# EasyEDA schematic meeting-meter-easyeda.json
TITLE: Meeting Meter; REV: RC5; Date: 2019-12-18; Sheet: 1/1
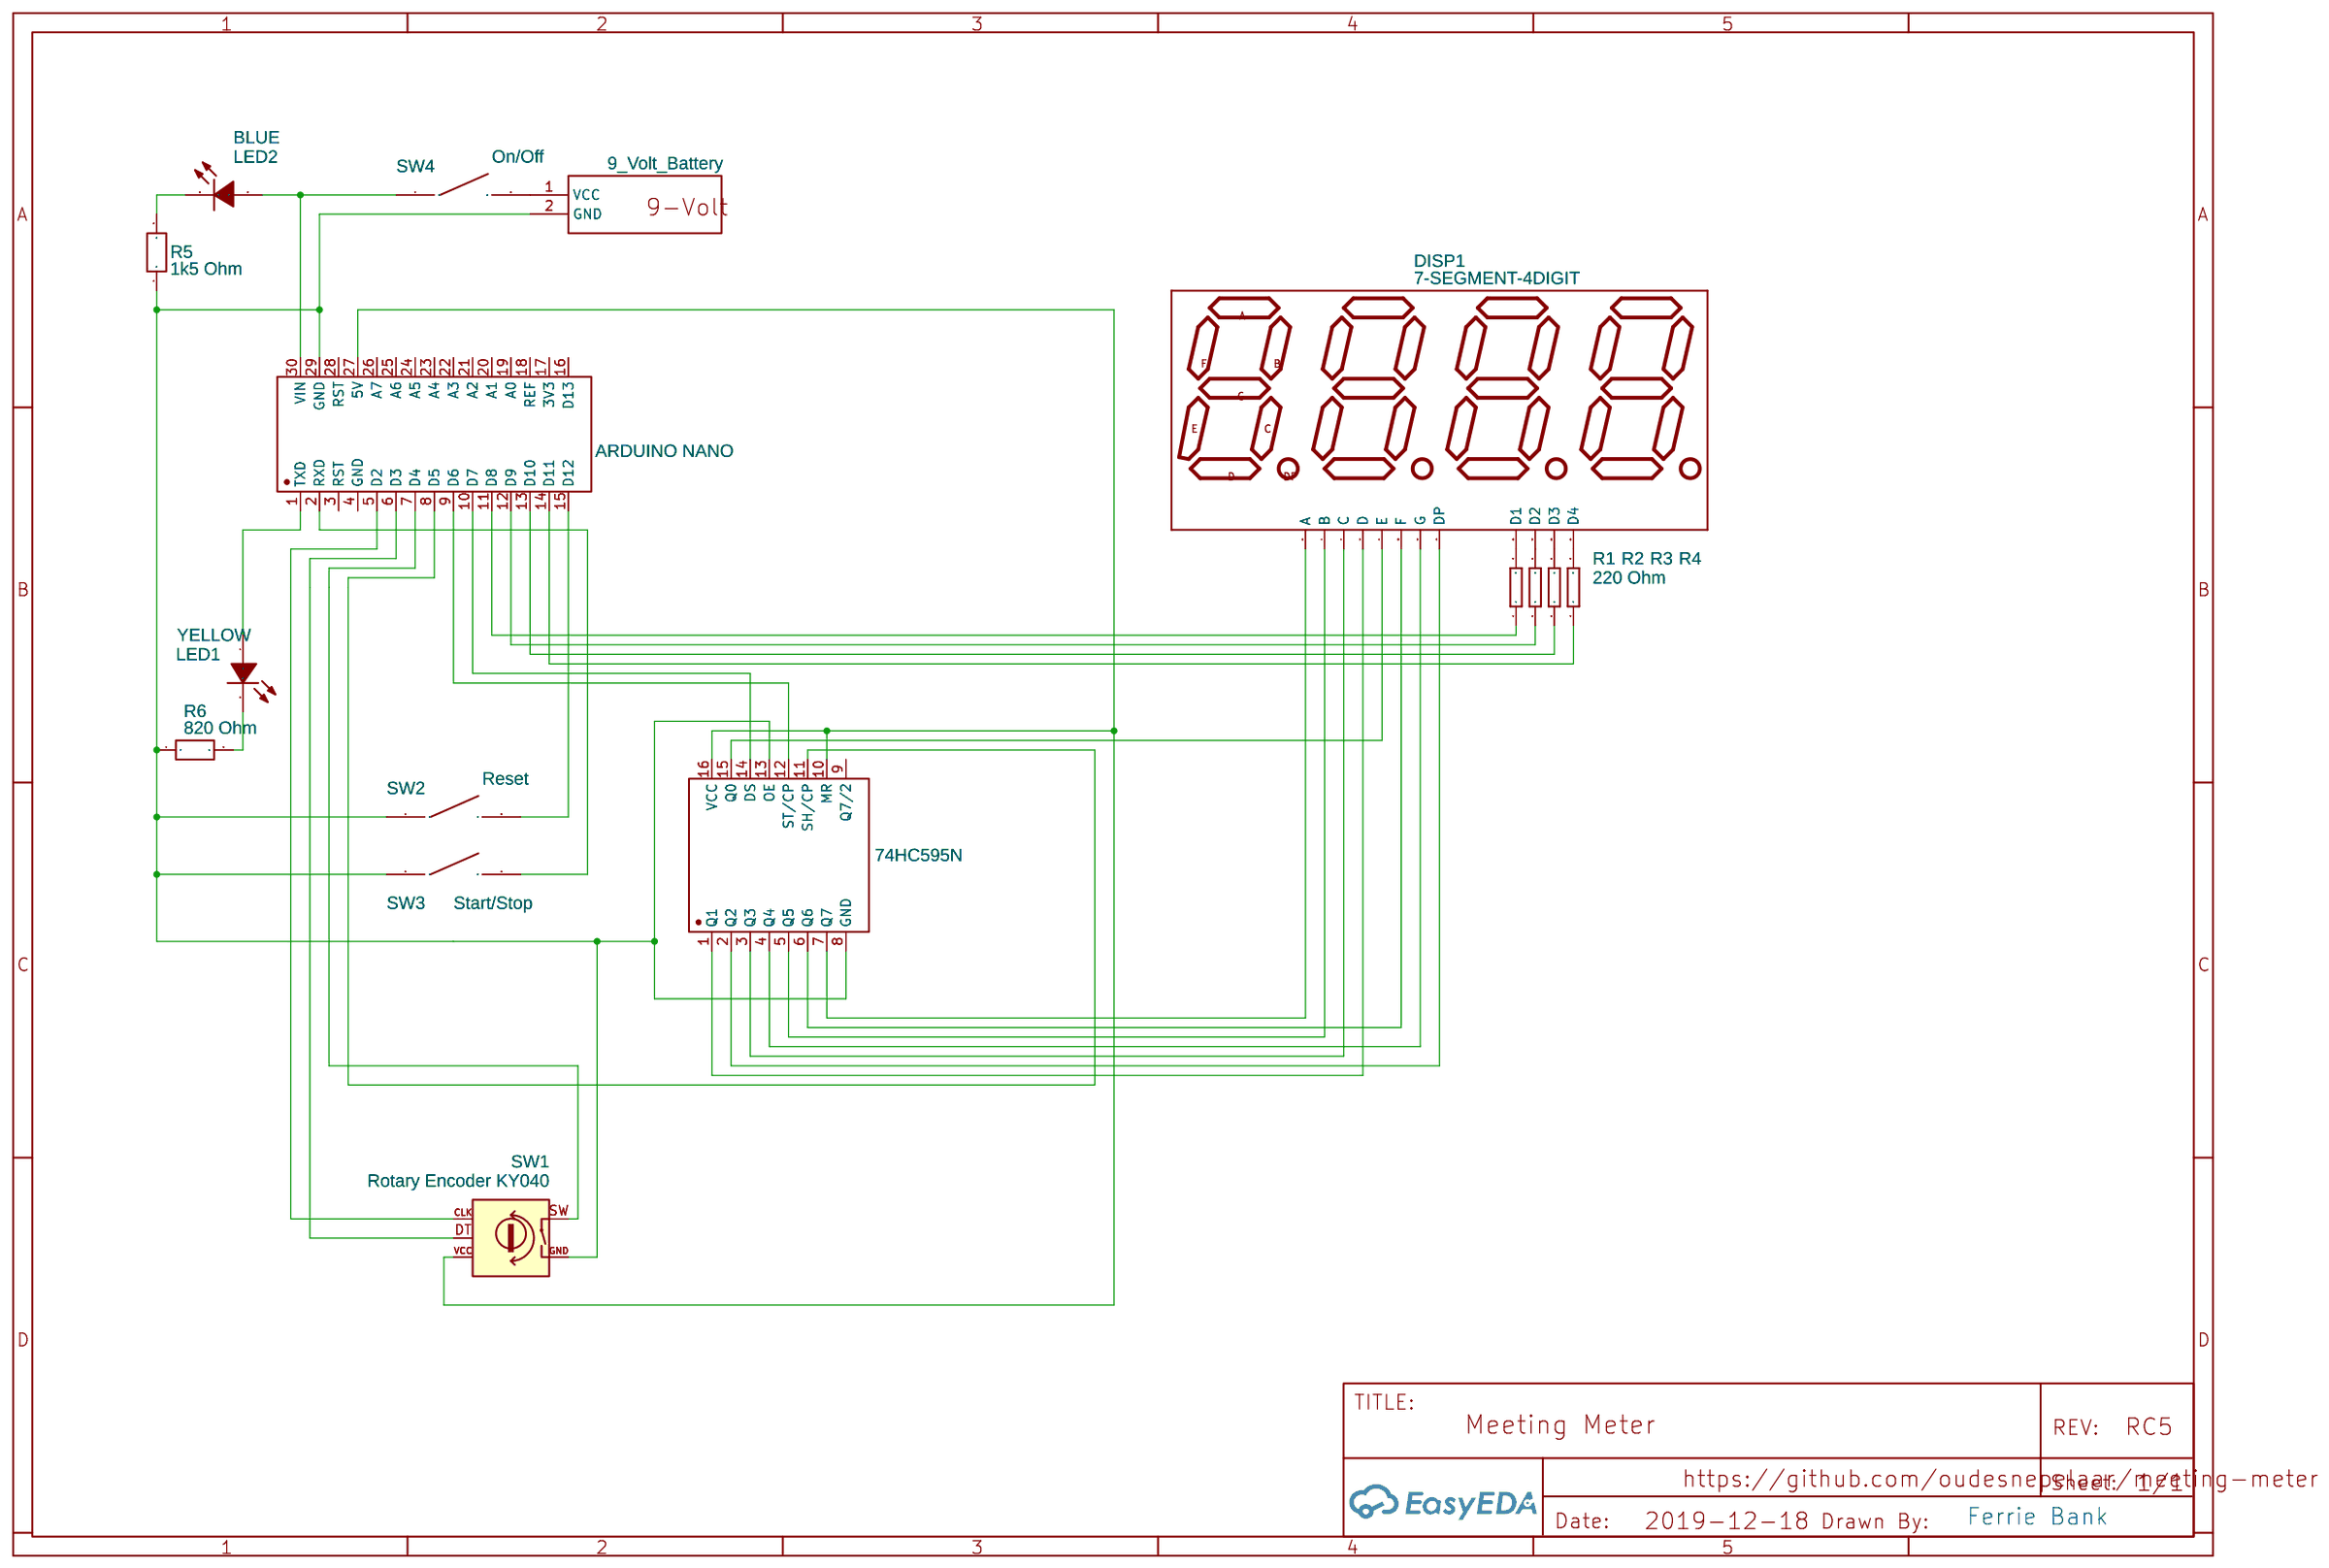
[diagram p0: schematic sheet]

## Parts
BT1  9_Volt_Battery  [BH9VW]
DISP1  7-SEGMENT-4DIGIT  [7-SEGMENT-4DIGIT-COUNTER]
LED1  YELLOW  [LED-3MM/2.54]
LED2  BLUE  [LED-3MM/2.54]
R1  220 Ohm  [RTH025W]
R2  RESISTOR  [RTH025W]
R3  RESISTOR  [RTH025W]
R4  RESISTOR  [RTH025W]
R5  1k5 Ohm  [AXIAL-0.3]
R6  820 Ohm  [AXIAL-0.3]
SW1  Rotary Encoder KY040
SW2  Reset  [KEY-6.0*6.0-4]
SW3  Start/Stop  [KEY-6.0*6.0-4]
SW4  On/Off  [KEY-6.0*6.0-4]
U1  74HC595N  [DIP16]
U2  ARDUINO NANO  [NUCLEO-L432KC]

## Library data of the parts
BT1 = -: Supplier Part: C9091; Supplier: LCSC; Manufacturer: ReliaPro; Manufacturer Part: No.7 battery3Section side by side battery box; Contributor: shivkrish39
DISP1 = -: Contributor: SparkFun
LED1 LED2 = -: Supplier: LCSC; Manufacturer: EVERLIGHT; Manufacturer Part: 204-10SURD/S530-A3; Supplier Part: C99772; color: yellow
R1 = -: Contributor: DangerousPrototype; Package Display: No
R2-R4 = -: Contributor: DangerousPrototype
R5 R6 = Res_AXIAL-0.3(1/8W)_EU
SW1 = -: Contributor: KiCAD; license: https://www.gnu.org/licenses/lgpl-2.1.html
SW2-SW4 = -: Supplier: LCSC; Manufacturer: PANASONIC; Manufacturer Part: EVQ22705R; Contributor: LCSC; Supplier Part: C79156
U2 = -: Supplier: LCSC; Manufacturer: STMicroelectronics; Supplier Part: C94814

## Nets
Net-(BT1-1): BT1.1(VCC) SW4.2
Net-(BT1-2): BT1.2(GND) R5.1 R6.1 SW1.GND SW2.1 SW3.1 U1.8(GND) U1.13(OE) U2.29(GND)
Net-(DISP1-1): DISP1.1(E) U1.15(Q0)
Net-(DISP1-2): DISP1.2(D) U1.1(Q1)
Net-(DISP1-3): DISP1.3(DP) U1.2(Q2)
Net-(DISP1-4): DISP1.4(C) U1.3(Q3)
Net-(DISP1-5): DISP1.5(G) U1.4(Q4)
Net-(DISP1-6): DISP1.6(D4) R4.2
Net-(DISP1-7): DISP1.7(B) U1.5(Q5)
Net-(DISP1-8): DISP1.8(D3) R3.2
Net-(DISP1-9): DISP1.9(D2) R2.2
Net-(DISP1-10): DISP1.10(F) U1.6(Q6)
Net-(DISP1-11): DISP1.11(A) U1.7(Q7)
Net-(DISP1-12): DISP1.12(D1) R1.2
Net-(LED1-1): LED1.1(A) U2.1(TXD)
Net-(LED1-2): LED1.2(K) R6.2
Net-(LED2-1): LED2.1(A) SW4.1 U2.30(VIN)
Net-(LED2-2): LED2.2(K) R5.2
Net-(R1-1): R1.1 U2.11(D8)
Net-(R2-1): R2.1 U2.12(D9)
Net-(R3-1): R3.1 U2.13(D10)
Net-(R4-1): R4.1 U2.14(D11)
Net-(SW1-CLK): SW1.CLK U2.5(D2)
Net-(SW1-DT): SW1.DT U2.6(D3)
Net-(SW1-SW): SW1.SW U2.7(D4)
Net-(SW1-VCC): SW1.VCC U1.10(MR) U1.16(VCC) U2.27(5V)
Net-(SW2-2): SW2.2 U2.15(D12)
Net-(SW3-2): SW3.2 U2.2(RXD)
Net-(U1-11): U1.11(SH/CP) U2.8(D5)
Net-(U1-12): U1.12(ST/CP) U2.9(D6)
Net-(U1-14): U1.14(DS) U2.10(D7)

Not connected (* = marked no-connect by the designer): U1 9(Q7/2); U2 3(RST) 4(GND) 16(D13) 17(3V3) 18(REF) 19(A0) 20(A1) 21(A2) 22(A3) 23(A4) 24(A5) 25(A6) 26(A7) 28(RST)

## Notes on the sheet
- Ferrie Bank
